# EAGLE schematic SW102_nRF51x22 (EAGLE 9.3.2)
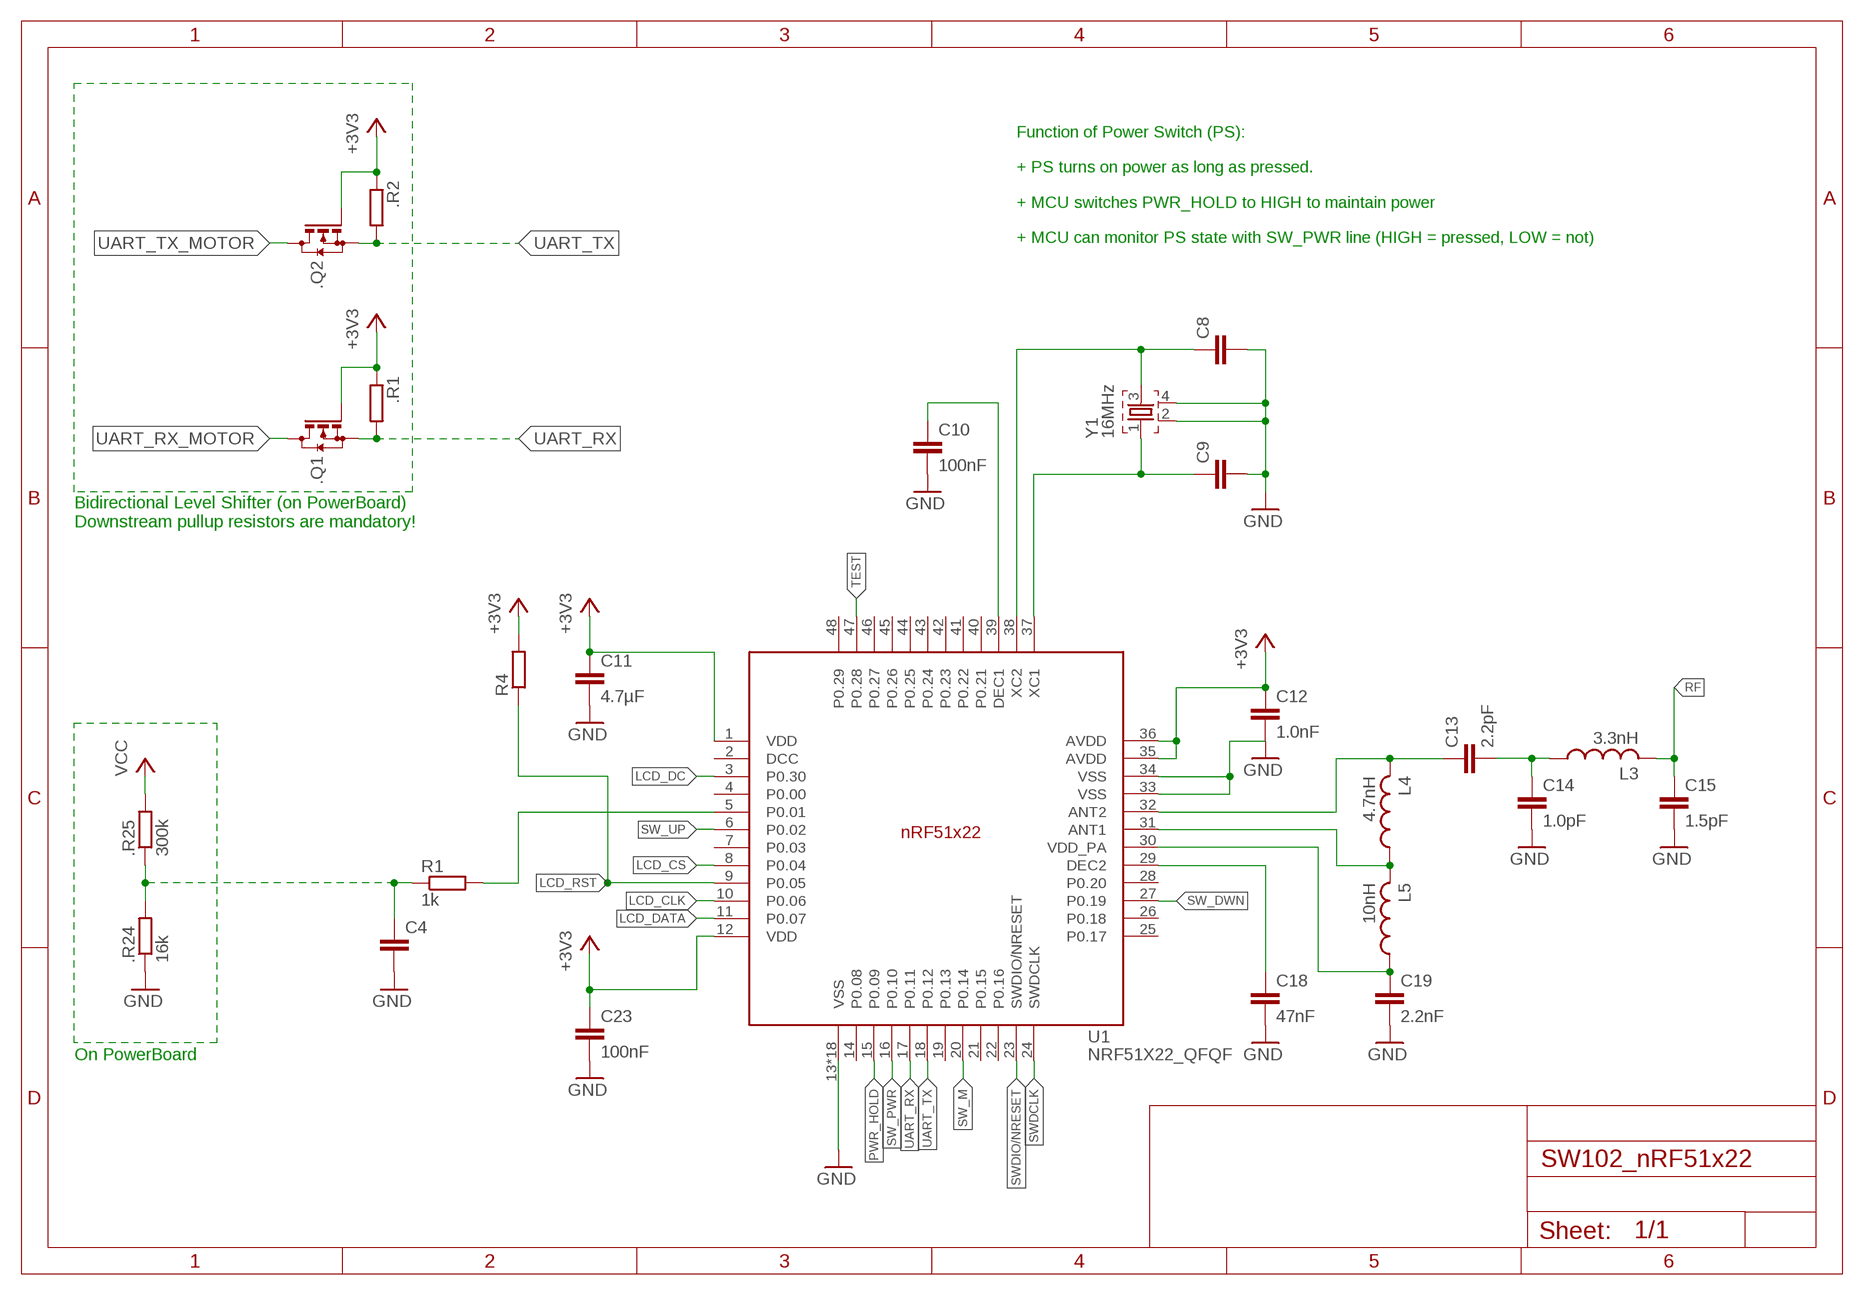
[diagram p0: schematic, sheet 1]

## Parts
.Q1  BSS123  [SOT23]
.Q2  BSS123  [SOT23]
.R1  R-EU_R0603  [R0603]
.R2  R-EU_R0603  [R0603]
.R24  16k  R-EU_R0603  [R0603]
.R25  300k  R-EU_R0603  [R0603]
C4  CAPACITOR_0402_N  [RESC0402_N]
C8  CAPACITOR_0402_N  [RESC0402_N]
C9  CAPACITOR_0402_N  [RESC0402_N]
C10  100nF  CAPACITOR_0402_N  [RESC0402_N]
C11  4.7µF  CAPACITOR_0603_N  [RESC0603_N]
C12  1.0nF  CAPACITOR_0402_N  [RESC0402_N]
C13  2.2pF  CAPACITOR_0402_N  [RESC0402_N]
C14  1.0pF  CAPACITOR_0402_N  [RESC0402_N]
C15  1.5pF  CAPACITOR_0402_N  [RESC0402_N]
C18  47nF  CAPACITOR_0402_N  [RESC0402_N]
C19  2.2nF  CAPACITOR_0402_N  [RESC0402_N]
C23  100nF  CAPACITOR_0402_N  [RESC0402_N]
L3  3.3nH  INDUCTOR_0402_N  [RESC0402_N]
L4  4.7nH  INDUCTOR_0402_N  [RESC0402_N]
L5  10nH  INDUCTOR_0402_N  [RESC0402_N]
R1  1k  R-EU_R0603  [R0603]
R4  R-EU_R0603  [R0603]
U1  NRF51X22_QFQF  [QFN40P600X600X90-48_N]
Y1  16MHz  XTAL_32MHZ  [BT-XTAL_2016_N]

## Nets
+3V3: .Q1.1(G) .Q2.1(G) .R1.1 .R2.1 C11.1 C12.1 C23.1 R4.2 U1.1(VDD) U1.12(VDD) U1.35(AVDD) U1.36(AVDD)
BAT+_ADC: R1.2 U1.5(P0.01)
GND: .R24.1 C4.2 C8.2 C9.2 C10.2 C11.2 C12.2 C14.2 C15.2 C18.2 C19.2 C23.2 U1.13(VSS) U1.33(VSS) U1.34(VSS) U1.PAD(VSS) U1.PAD@VIA01(VSS) U1.PAD@VIA02(VSS) U1.PAD@VIA03(VSS) U1.PAD@VIA04(VSS) U1.PAD@VIA05(VSS) U1.PAD@VIA06(VSS) U1.PAD@VIA07(VSS) U1.PAD@VIA08(VSS) U1.PAD@VIA09(VSS) U1.PAD@VIA10(VSS) U1.PAD@VIA11(VSS) U1.PAD@VIA12(VSS) U1.PAD@VIA13(VSS) U1.PAD@VIA14(VSS) U1.PAD@VIA15(VSS) U1.PAD@VIA16(VSS) Y1.2 Y1.4
LCD_CLK: U1.10(P0.06)
LCD_CS: U1.8(P0.04)
LCD_DATA: U1.11(P0.07)
LCD_DC: U1.3(P0.30)
LCD_RST: R4.1 U1.9(P0.05)
N$1: L4.1 L5.2 U1.31(ANT1)
N$3: C8.1 U1.38(XC2) Y1.3
N$4: .R24.2 .R25.1 C4.1 R1.1
N$5: C18.1 U1.29(DEC2)
N$6: C10.1 U1.39(DEC1)
N$7: C19.1 L5.1 U1.30(VDD_PA)
N$9: C13.1 L4.2 U1.32(ANT2)
N$10: C13.2 C14.1 L3.1
PWR_HOLD: U1.15(P0.09)
RF: C15.1 L3.2
SW_DWN: U1.27(P0.19)
SW_M: U1.20(P0.14)
SW_PWR: U1.16(P0.10)
SW_UP: U1.6(P0.02)
SWDCLK: U1.24(SWDCLK)
SWDIO/NRESET: U1.23(SWDIO/NRESET)
TEST: U1.47(P0.28)
UART_RX: .Q1.2(S) .R1.2 U1.17(P0.11)
UART_RX_MOTOR: .Q1.3(D)
UART_TX: .Q2.2(S) .R2.2 U1.18(P0.12)
UART_TX_MOTOR: .Q2.3(D)
VCC: .R25.2
X1: C9.1 U1.37(XC1) Y1.1
Unconnected: U1.4(P0.00) U1.7(P0.03) U1.14(P0.08) U1.19(P0.13) U1.21(P0.15) U1.22(P0.16) U1.25(P0.17) U1.26(P0.18) U1.28(P0.20) U1.40(P0.21) U1.41(P0.22) U1.42(P0.23) U1.43(P0.24) U1.44(P0.25) U1.45(P0.26) U1.46(P0.27) U1.48(P0.29)

## Notes on the sheet
- Function of Power Switch (PS):
  
  + PS turns on power as long as pressed.
  
  + MCU switches PWR_HOLD to HIGH to maintain power
  
  + MCU can monitor PS state with SW_PWR line (HIGH = pressed, LOW = not)
- Bidirectional Level Shifter (on PowerBoard)
  Downstream pullup resistors are mandatory!
- On PowerBoard

## Power pins joined to a net without a drawn wire
DCC: U1.2(DCC)

## Library data of the parts
.Q1 .Q2 = transistor-small-signal:BSS123: N-CHANNEL MOS FET
.R1 .R2 .R24 .R25 R1 R4 = rcl:R-EU_: RESISTOR, European symbol; SPICEPREFIX: R
C4 C8-C15 C18 C19 C23 = Nordic_nRF:CAPACITOR: Generic chip capacitor
L3-L5 = Nordic_nRF:INDUCTOR: Generic chip inductor
U1 = Nordic_nRF:NRF51X22_QF: nRF51x22 For devices: nRF51422 nRF51822 Features Single chip, highly flexible, 2.4 GHz multi-protocol device 32-bit ARM Cortex M0 CPU core 256kB/128kB flash + 32kB/16kB RAM Supports Bluetooth low energy protocol stacks Thread safe and run-time protected Event driven API On air compatible with nRF24L series 3 data rates (2Mbps/1Mbps/250kbps) +4dBm output power -93dBm sensitivity, Bluetooth low energy PPI system for maximum power-efficient applications and code simplification Flexible power management system with automatic power management of each peripheral Configurable I/O mapping for analog and digital I/O Applications Mobile phone accessories Wearables Beacons Rezence wireless charging monitoring PC peripherals Consumer Electronics (CE) remote controls Proximity/Alert sensors Smart Home Sports, fitness and healthcare sensors Smart RF tags Toys and electronic games Intelligent domestic appliances Industrial and commercial sensors Lighting
Y1 = Nordic_nRF:XTAL_32MHZ